# Altium schematic sheet Sheet1.SchDoc
size A4; SheetNumber: 1; SheetTotal: 1
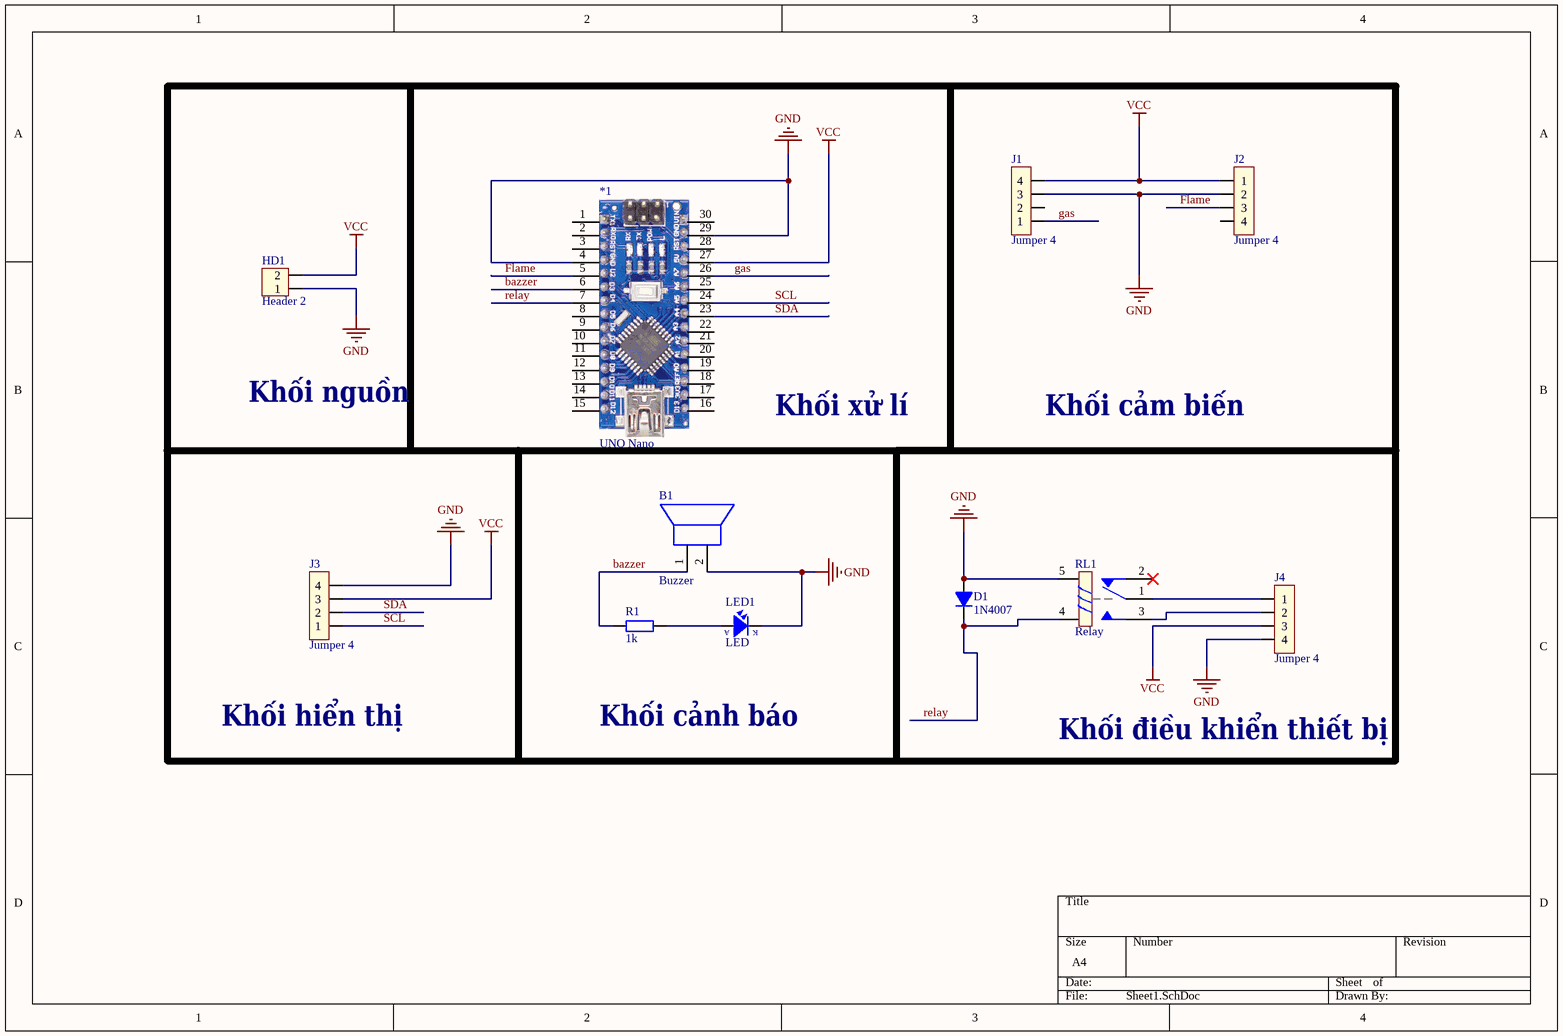
[diagram p0: Sheet1.SchDoc]

## Parts
*1  UNO Nano  [UNO Nano]
B1  Buzzer  [Buzzer]
D1  1N4007  [D1A]
HD1  Header 2  [HED2]
J1  Jumper 4  [JP4]
J2  Jumper 4  [JP4]
J3  Jumper 4  [JP4]
J4  Jumper 4  [JP4]
LED1  LED  [LED-5]
R1  1k  [R1/4W]
RL1  Relay  [RL_SPDT_10A]

## Nets
GND: *1.4(GND) *1.29(GND) B1.2(-) D1.1(A) HD1.1 J1.3 J2.2 J3.4 J4.4 LED1.2(K) RL1.5
VCC: *1.27(5V) HD1.2 J1.4 J2.1 J3.3 J4.3
bazzer: *1.6(D3) B1.1(+) R1.1
Flame: *1.5(D2) J2.3
gas: *1.26(A7) J1.1
relay: *1.7(D4) D1.2(K) RL1.4
SCL: *1.24(A5) J3.1
SDA: *1.23(A4) J3.2
NetJ4_1: J4.1 RL1.1
NetJ4_2: J4.2 RL1.3
NetLED1_1: LED1.1(A) R1.2

Not connected (* = marked no-connect by the designer): *1 1(TX) 2(RX) 3(RST) 8(D5) 9(D6) 10(D7) 11(D8) 12(D9) 13(D10) 14(D11) 15(D12) 16(D13) 17(3V3) 18(REF) 19(A0) 20(A1) 21(A2) 22(A3) 25(A6) 28(RST) 30(VIN); J1 2; J2 4; RL1 2*

## Notes on the sheet
- Khối nguồn
- Khối xử lí
- Khối cảm biến
- Khối hiển thị
- Khối cảnh báo
- Khối điều khiển thiết bị

## Library data of the parts
D1 = D1A: Diode 1A; Value: 1N4007
HD1 = Hed2: Header 2 (Green); Value: Header 2
J1-J4 = JP4: Value: J3
LED1 = LED: LED Single colour Green and Red; Value: LED 3 ly Single Colour
R1 = R1/4W: Resistor 1/4W; Value: R1/4W - 1K
RL1 = Relay 1: Relay SPDT 5 Pin; Value: Relay SPDT, 10A, 12V